# Altium schematic sheet FTDI.SchDoc
size A4; Organization: Altium Limited; Address1: L3, 12a Rodborough Rd; Address2: Frenchs Forest; Address3: NSW; Address4: Australia 2086
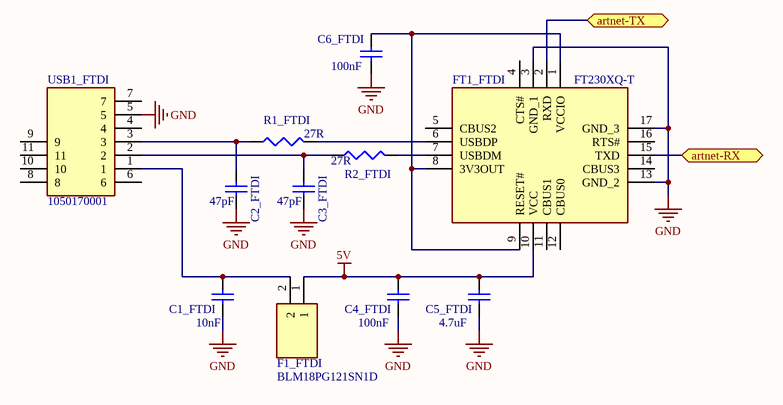
[diagram p0: FTDI.SchDoc]

## Parts
C1_FTDI  value 10nF  [1608[0603]]  (hidden comment: Cap Semi)
C2_FTDI  value 47pF  [1608[0603]]  (hidden comment: Cap Semi)
C3_FTDI  value 47pF  [1608[0603]]  (hidden comment: Cap Semi)
C4_FTDI  value 100nF  [1608[0603]]  (hidden comment: Cap Semi)
C5_FTDI  value 4.7uF  [1608[0603]]  (hidden comment: Cap Semi)
C6_FTDI  value 100nF  [1608[0603]]  (hidden comment: Cap Semi)
F1_FTDI  BLM18PG121SN1D  [BEADC1608X95N]
FT1_FTDI  FT230XQ-T  [QFN65P400X400X80-17N]
R1_FTDI  value 27R  [J1-0603]  (hidden comment: Res3)
R2_FTDI  value 27R  [J1-0603]  (hidden comment: Res3)
USB1_FTDI  1050170001  [MICROUSB-BTYPE]

## Ports
artnet-RX, artnet-TX

## Nets
5V: C4_FTDI.2 C5_FTDI.2 F1_FTDI.1 FT1_FTDI.10(VCC)
GND: C1_FTDI.1 C2_FTDI.1 C3_FTDI.1 C4_FTDI.1 C5_FTDI.1 C6_FTDI.2 FT1_FTDI.3(GND_1) FT1_FTDI.13(GND_2) FT1_FTDI.17(GND_3) USB1_FTDI.5
artnet-RX: FT1_FTDI.15(TXD) ; port artnet-RX
artnet-TX: FT1_FTDI.2(RXD) ; port artnet-TX
NetC1_FTDI_2: C1_FTDI.2 F1_FTDI.2 USB1_FTDI.1
NetC2_FTDI_2: C2_FTDI.2 R1_FTDI.1 USB1_FTDI.3
NetC3_FTDI_2: C3_FTDI.2 R2_FTDI.1 USB1_FTDI.2
NetC6_FTDI_1: C6_FTDI.1 FT1_FTDI.1(VCCIO) FT1_FTDI.8(3V3OUT) FT1_FTDI.9(RESET#)
NetFT1_FTDI_6: FT1_FTDI.6(USBDP) R1_FTDI.2
NetFT1_FTDI_7: FT1_FTDI.7(USBDM) R2_FTDI.2

Not connected (* = marked no-connect by the designer): FT1_FTDI 4(CTS#) 5(CBUS2) 11(CBUS1) 12(CBUS0) 14(CBUS3) 16(RTS#); USB1_FTDI 4 6 7 8 9 10 11

## Notes on the sheet
- Title
- Size:
- Date:
- A4
- Number:
- Time:
- Revision:
- Sheet
- of
- File:

## Library data of the parts
C1_FTDI C2_FTDI C3_FTDI C4_FTDI C5_FTDI C6_FTDI = Cap Semi: Capacitor (Semiconductor SIM Model); Published: 8-Jun-2000; LatestRevisionDate: 29-May-2009; LatestRevisionNote: IPC-7351 Footprint Added.; PackageReference: C1206; Publisher: Altium Limited; PackageDescription: Chip Capacitor
F1_FTDI = BLM18PG121SN1D: Filter; Manufacturer_Name: Murata Electronics; Datasheet Link: https://www.murata.com/en-us/products/productdetail?partno=BLM18PG121SN1%23; Height: 0.95mm; Manufacturer_Part_Number: BLM18PG121SN1D; Mouser Part Number: 81-BLM18PG121SN1D; Mouser Price/Stock: https://www.mouser.com/Search/Refine.aspx?Keyword=81-BLM18PG121SN1D; RS Part Number: 7241380P; RS Price/Stock: http://uk.rs-online.com/web/p/products/7241380P
FT1_FTDI = FT230XQ-T: Integrated Circuit; Manufacturer_Name: FTDI Chip; Allied_Number: 70403915; Datasheet Link: https://www.ftdichip.com/Support/Documents/DataSheets/ICs/DS_FT230X.pdf; Height: 0.8mm; Manufacturer_Part_Number: FT230XQ-T; Mouser Part Number: 895-FT230XQ-T; Mouser Price/Stock: https://www.mouser.com/Search/Refine.aspx?Keyword=895-FT230XQ-T; RS Part Number: 8888716; RS Price/Stock: http://uk.rs-online.com/web/p/products/8888716; Allied Price/Stock: https://www.alliedelec.com/ftdi-ft230xq-t/70403915/
R1_FTDI R2_FTDI = Res3: Resistor; Published: 8-Jun-2000; LatestRevisionDate: 29-May-2009; LatestRevisionNote: IPC-7351 Footprint Added.; PackageReference: J1-0603; Publisher: Altium Limited; PackageDescription: Chip Resistor
USB1_FTDI = 1050170001: Connector; Manufacturer_Name: Molex; Datasheet Link: http://www.mouser.com/ds/2/276/1050170001_IO_CONNECTORS-230168.pdf; Manufacturer_Part_Number: 1050170001; Mouser Part Number: N/A; Mouser Price/Stock: https://www.mouser.com/Search/Refine.aspx?Keyword=N%2FA